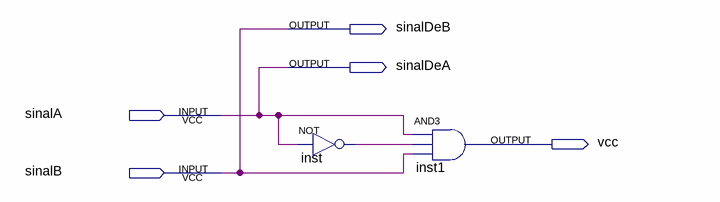
[diagram p0: schematic sheet]
// Quartus schematic MaiorQueSinal.bdf as structural Verilog: 2 symbols, 5 pins
module MaiorQueSinal (
  input  sinalA,
  input  sinalB,
  output sinalDeB,
  output sinalDeA,
  output vcc
);

  wire inst_out;

  not inst (inst_out, sinalA);
  and inst1 (vcc, sinalA, inst_out, sinalB);

  assign sinalDeA = sinalA;
  assign sinalDeB = sinalB;
endmodule
